# EAGLE design tssop28breakout (EAGLE 7.7.0)
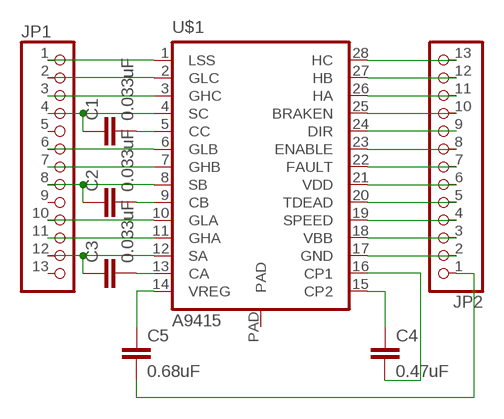
[diagram p0: schematic, sheet 1]

## Parts
C1  0.033uF  C-EUC0805  [C0805]
C2  0.033uF  C-EUC0805  [C0805]
C3  0.033uF  C-EUC0805  [C0805]
C4  0.47uF  C-EUC0805  [C0805]
C5  0.68uF  C-EUC0805  [C0805]
JP1  PINHD-1X13_BIG  [1X13-BIG]
JP2  PINHD-1X13_BIG  [1X13-BIG]
U$1  A9415  [TSSOP28]

## Nets
BRAKEN: JP2.10 U$1.25(BRAKEN)
CA: C3.2 U$1.13(CA)
CB: C2.2 U$1.9(CB)
CC: C1.2 U$1.5(CC)
DIR: JP2.9 U$1.24(DIR)
ENABLE: JP2.8 U$1.23(ENABLE)
FAULT: JP2.7 U$1.22(FAULT)
GHA: JP1.11 U$1.11(GHA)
GHB: JP1.7 U$1.7(GHB)
GHC: JP1.3 U$1.3(GHC)
GLA: JP1.10 U$1.10(GLA)
GLB: JP1.6 U$1.6(GLB)
GLC: JP1.2 U$1.2(GLC)
GND: JP2.2 U$1.17(GND)
HA: JP2.11 U$1.26(HA)
HB: JP2.12 U$1.27(HB)
HC: JP2.13 U$1.28(HC)
LSS: JP1.1 U$1.1(LSS)
N$26: C4.1 U$1.15(CP2)
N$27: C4.2 U$1.16(CP1)
SA: C3.1 JP1.12 U$1.12(SA)
SB: C2.1 JP1.8 U$1.8(SB)
SC: C1.1 JP1.4 U$1.4(SC)
SPEED: JP2.4 U$1.19(SPEED)
TDEAD: JP2.5 U$1.20(TDEAD)
VBB: JP2.3 U$1.18(VBB)
VDD: JP2.6 U$1.21(VDD)
VREG: C5.1 U$1.14(VREG)
VREG_GND: C5.2 JP2.1
Unconnected: JP1.5 JP1.9 JP1.13

## Power pins joined to a net without a drawn wire
PAD: U$1.PAD

## Library data of the parts
C1-C5 = resistor:C-EU: CAPACITOR, European symbol
JP1 JP2 = adafruit:PINHD-1X13: PIN HEADER
U$1 = dedo:A9415: A4915 3-Phase MOSFET Driver The A4915 is designed for pulse width modulated (PWM) current control of 3-phase brushless DC motors. The A4915 is capable of high current gate drive for 6 all N-channel power MOSFETs. An internal charge pump ensures gate drive down to 7 V supply and provides limited gate drive down to 5 V. A bootstrap capacitor is used to generate a supply voltage greater than the source voltage of the high side MOSFET, required for N-channel MOSFETs. Details see: http://www.allegromicro.com/~/media/Files/Datasheets/A4915-Datasheet.ashx?la=en

## Board
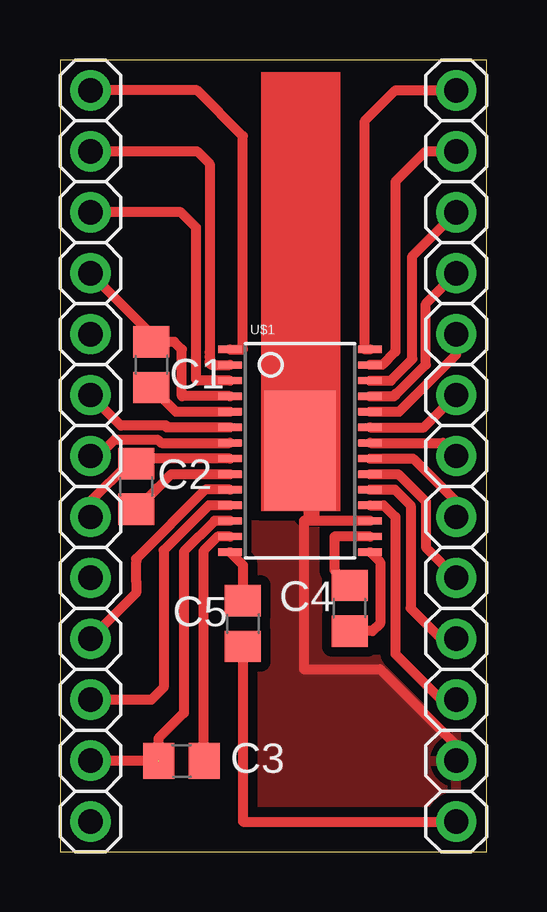
[diagram p1: board, top side]

Size 17.78 x 33.02 mm. Coordinates in mm from the lower left corner, seen from the top.
Outline: 0,0 17.78,0 17.78,33.02 0,33.02 0,0
Copper layers (1*16): Top 0.035mm / dielectric 1.5mm / Bottom 0.035mm
Design rules "default": minimum track width 6mil, minimum drill 0.35mm, track to track 6mil, track to pad 6mil, pad to pad 6mil, via to via 6mil, smd to smd 6mil, copper to edge 40mil, drill to drill 6mil, minimum pad ring 10mil, minimum via ring 8mil, stop-mask expansion 4mil, vias tented up to drill 0mil, thermal gap 10mil

### Footprints (pad centres in the part's own frame; a part is rotated, then mirrored left to right if it is on the bottom)
C0805 = smd 1.3 x 1.5: 1 -0.95,0; 2 0.95,0
1X13-BIG = drill 1.016 pad 1.676: 1 -15.24,0; 2 -12.7,0; 3 -10.16,0; 4 -7.62,0; 5 -5.08,0; 6 -2.54,0; 7 0,0; 8 2.54,0; 9 5.08,0; 10 7.62,0; 11 10.16,0; 12 12.7,0; 13 15.24,0
TSSOP28 = smd 0.305 x 0.991: 1 -4.225,-2.918; 2 -3.575,-2.918; 3 -2.925,-2.918; 4 -2.275,-2.918; 5 -1.625,-2.918; 6 -0.975,-2.918; 7 -0.325,-2.918; 8 0.325,-2.918; 9 0.975,-2.918; 10 1.625,-2.918; 11 2.275,-2.918; 12 2.925,-2.918; 13 3.575,-2.918; 14 4.225,-2.918; 15 4.225,2.918; 16 3.575,2.918; 17 2.925,2.918; 18 2.275,2.918; 19 1.625,2.918; 20 0.975,2.918; 21 0.325,2.918; 22 -0.325,2.918; 23 -0.975,2.918; 24 -1.625,2.918; 25 -2.275,2.918; 26 -2.925,2.918; 27 -3.575,2.918; 28 -4.225,2.918 | smd 5 x 3: PAD 0,0

### Placement (x,y rotation side)
C1  3.81,20.32 270 top
C2  3.17,15.24 270 top
C3  5.07,3.79 0 top
C4  12.06,10.16 90 top
C5  7.62,9.53 270 top
JP1  1.27,16.51 270 top
JP2  16.51,16.51 90 top
U$1  10,16.73 270 top

### Tracks (layer width: path | path; a pad name or v marks a point on that pad's centre or on a via)
BRAKEN
  Top 0.406: U$1.25 13.93,19 13.97,19.05 | 13.97,19.05 13.97,19.1 | 13.97,19.05 15.24,20.32 15.24,22.86 JP2.10
CA
  Top 0.406: U$1.13 6.58,13.15 5.98,12.55 5.98,4.36 6.28,4.06 C3.2
CB
  Top 0.406: C2.2 4.07,15.18 4.64,15.76 U$1.9
CC
  Top 0.406: C1.2 4.83,18.36 U$1.5
DIR
  Top 0.406: U$1.24 14.13,18.36 16.51,20.74 JP2.9
ENABLE
  Top 0.406: U$1.23 15.16,17.7 JP2.8
FAULT
  Top 0.406: U$1.22 15.96,17.05 JP2.7
GHA
  Top 0.406: U$1.11 6.2,14.46 4.32,12.57 4.32,6.86 3.81,6.35 JP1.11
GHB
  Top 0.406: JP1.7 1.59,16.51 2.28,17.2 4.07,17.2 4.21,17.05 U$1.7
GHC
  Top 0.406: U$1.3 5.71,19.66 5.67,19.7 5.67,26.04 5.04,26.67 JP1.3
GLA
  Top 0.406: JP1.10 3.17,10.79 3.17,11.31 3.17,12.06 3.17,12.22 6.06,15.11 U$1.10
GLB
  Top 0.406: U$1.6 4.45,17.7 4.45,17.78 2.54,17.78 JP1.6
GLC
  Top 0.406: 6.37,20.3 U$1.2 | 6.35,20.32 arc90 6.37,20.3 | JP1.2 5.71,29.21 6.23,28.69 6.23,20.83 | 6.23,20.83 6.23,20.66 | 6.23,20.83 6.23,20.44 arc90 6.37,20.3
GND
  Top 0.406: U$1.17 10.16,13.8 10.16,7.62 13.34,7.62 16.51,4.45 JP2.2
  pour Top (isolate 0.406): 0,0 17.78,0 17.78,33.02 0,33.02
HA
  Top 0.406: U$1.26 13.79,19.66 14.68,20.55 14.68,24.84 JP2.11
HB
  Top 0.406: JP2.12 15.24,29.21 13.97,27.94 13.97,20.86 13.42,20.3 U$1.27
HC
  Top 0.406: U$1.28 12.7,20.95 12.7,30.48 13.97,31.75 JP2.13
LSS
  Top 0.406: U$1.1 7.62,20.95 7.62,29.84 5.71,31.75 JP1.1
N$26
  Top 0.406: U$1.15 13.34,12.09 13.34,9.53 13.02,9.21 C4.1
N$27
  Top 0.406: U$1.16 11.43,13.15 11.43,11.74 C4.2
SA  (1 unrouted)
  Top 0.406: JP1.12 4.1,3.81 4.1,4.74 5.17,5.8 5.17,12.53 6.44,13.8 U$1.12
SB
  Top 0.406: U$1.8 3.39,16.41 C2.1 2.85,16.19 1.27,14.61 JP1.8
SC
  Top 0.406: JP1.4 3.81,21.59 C1.1 4.76,21.27 5.08,20.95 5.08,19 U$1.4
SPEED
  Top 0.406: U$1.19 13.95,15.11 14.61,14.45 14.61,10.16 15.88,8.89 JP2.4
TDEAD
  Top 0.406: JP2.5 15.24,12.7 15.24,14.61 14.09,15.76 U$1.20
VBB
  Top 0.406: U$1.18 13.48,14.46 13.97,13.97 13.97,8.26 15.88,6.35 JP2.3
VDD
  Top 0.406: JP2.6 16.51,14.61 14.71,16.41 U$1.21
VREG
  Top 0.406: U$1.14 7.62,11.97 C5.1
VREG_GND
  Top 0.406: C5.2 7.62,1.27 JP2.1
(copper drawn outside any net)
  shapes: Top area x2